# Altium schematic sheet Sheet_1_(2)_22.11.2023 _2023-11-22.schdoc
size 339 x 300 mm
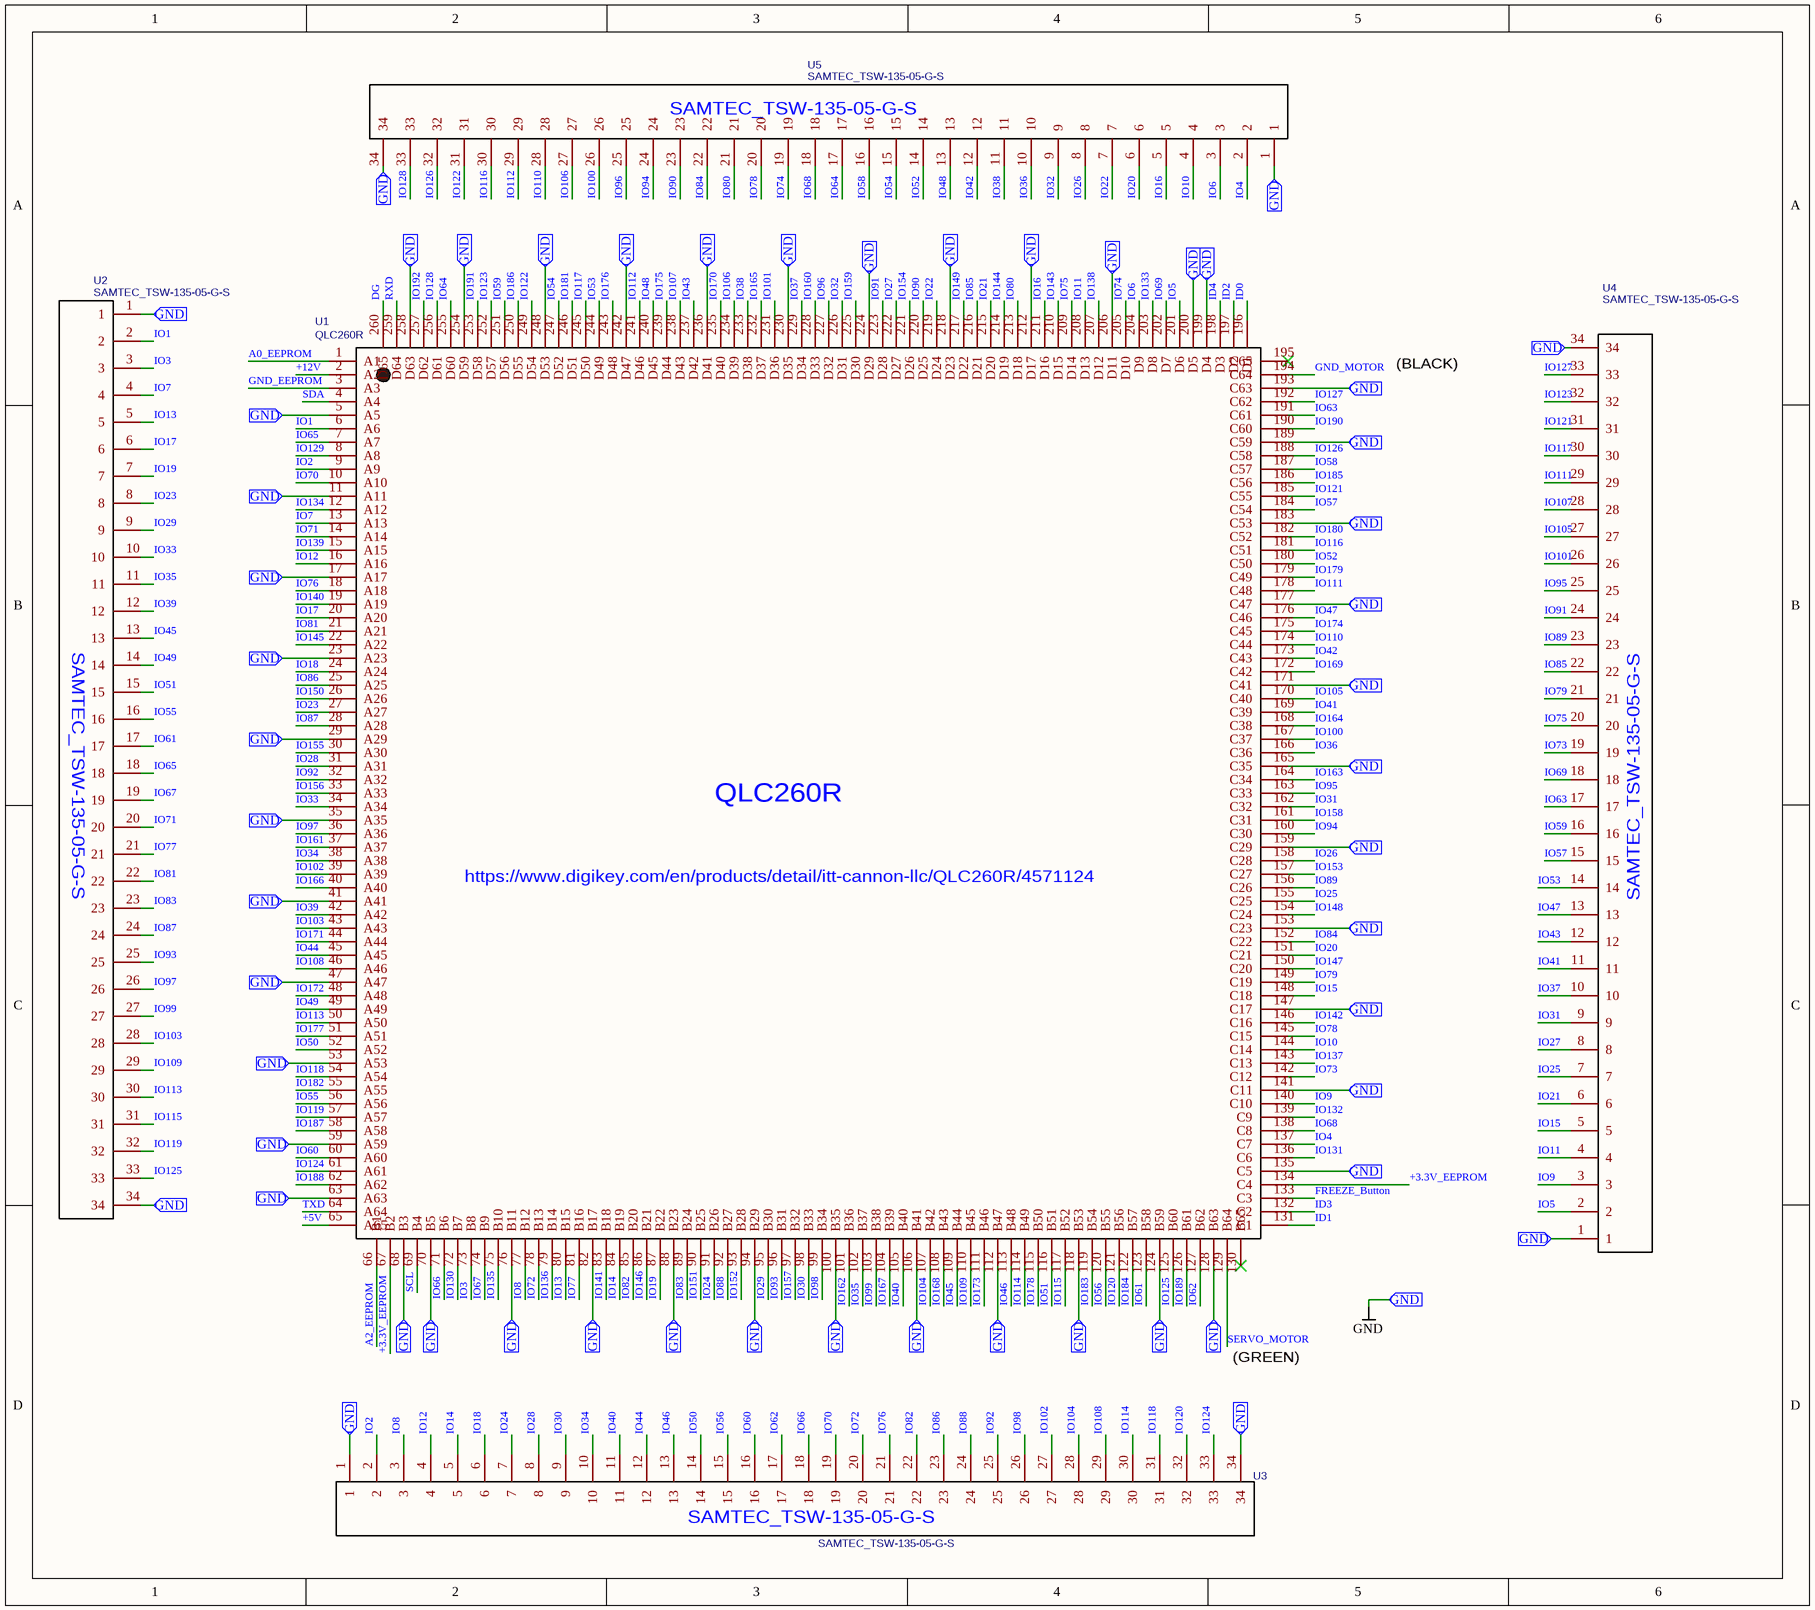
[diagram p0: Sheet_1_(2)_22.11.2023 _2023-11-22.schdoc]

## Parts
U1  QLC260R  [QLC 260R _CONNECTOR_H]
U2  SAMTEC_TSW-135-05-G-S  [CONNECTOR_01X34_SAMTECH_B]
U3  SAMTEC_TSW-135-05-G-S  [CONNECTOR_01X34_SAMTECH_B]
U4  SAMTEC_TSW-135-05-G-S  [CONNECTOR_01X34_SAMTECH_B]
U5  SAMTEC_TSW-135-05-G-S  [CONNECTOR_01X34_SAMTECH_B]

## Ports
GND (in)

## Nets
GND: U1.5(A5) U1.11(A11) U1.17(A17) U1.23(A23) U1.29(A29) U1.35(A35) U1.41(A41) U1.47(A47) U1.53(A53) U1.59(A59) U1.63(A63) U1.68(B3) U1.70(B5) U1.76(B11) U1.82(B17) U1.88(B23) U1.94(B29) U1.100(B35) U1.106(B41) U1.112(B47) U1.118(B53) U1.124(B59) U1.128(B63) U1.135(C5) U1.141(C11) U1.147(C17) U1.153(C23) U1.159(C29) U1.165(C35) U1.171(C41) U1.177(C47) U1.183(C53) U1.189(C59) U1.193(C63) U1.199(D4) U1.200(D5) U1.206(D11) U1.212(D17) U1.218(D23) U1.224(D29) U1.230(D35) U1.236(D41) U1.242(D47) U1.248(D53) U1.254(D59) U1.258(D63) U2.1 U2.34 U3.1 U3.34 U4.1 U4.34 U5.1 U5.34 ; port GND
+3.3V_EEPROM: U1.67(B2) U1.134(C4)
+5V: U1.65(A65)
+12V: U1.2(A2)
A0_EEPROM: U1.1(A1)
A2_EEPROM: U1.66(B1)
DG: U1.260(D65)
FREEZE_Button: U1.133(C3)
GND_EEPROM: U1.3(A3)
GND_MOTOR: U1.194(C64)
ID0: U1.196(D1)
ID1: U1.131(C1)
ID2: U1.197(D2)
ID3: U1.132(C2)
ID4: U1.198(D3)
IO1: U1.6(A6) U2.2
IO2: U1.9(A9) U3.2
IO3: U1.73(B8) U2.3
IO4: U1.137(C7) U5.2
IO5: U1.201(D6) U4.2
IO6: U1.204(D9) U5.3
IO7: U1.13(A13) U2.4
IO8: U1.77(B12) U3.3
IO9: U1.140(C10) U4.3
IO10: U1.144(C14) U5.4
IO11: U1.208(D13) U4.4
IO12: U1.16(A16) U3.4
IO13: U1.80(B15) U2.5
IO14: U1.84(B19) U3.5
IO15: U1.148(C18) U4.5
IO16: U1.211(D16) U5.5
IO17: U1.20(A20) U2.6
IO18: U1.24(A24) U3.6
IO19: U1.87(B22) U2.7
IO20: U1.151(C21) U5.6
IO21: U1.215(D20) U4.6
IO22: U1.219(D24) U5.7
IO23: U1.27(A27) U2.8
IO24: U1.91(B26) U3.7
IO25: U1.155(C25) U4.7
IO26: U1.158(C28) U5.8
IO27: U1.222(D27) U4.8
IO28: U1.31(A31) U3.8
IO29: U1.95(B30) U2.9
IO30: U1.98(B33) U3.9
IO31: U1.162(C32) U4.9
IO32: U1.226(D31) U5.9
IO33: U1.34(A34) U2.10
IO34: U1.38(A38) U3.10
IO35: U1.102(B37) U2.11
IO36: U1.166(C36) U5.10
IO37: U1.229(D34) U4.10
IO38: U1.233(D38) U5.11
IO39: U1.42(A42) U2.12
IO40: U1.105(B40) U3.11
IO41: U1.169(C39) U4.11
IO42: U1.173(C43) U5.12
IO43: U1.237(D42) U4.12
IO44: U1.45(A45) U3.12
IO45: U1.109(B44) U2.13
IO46: U1.113(B48) U3.13
IO47: U1.176(C46) U4.13
IO48: U1.240(D45) U5.13
IO49: U1.49(A49) U2.14
IO50: U1.52(A52) U3.14
IO51: U1.116(B51) U2.15
IO52: U1.180(C50) U5.14
IO53: U1.244(D49) U4.14
IO54: U1.247(D52) U5.15
IO55: U1.56(A56) U2.16
IO56: U1.120(B55) U3.15
IO57: U1.184(C54) U4.15
IO58: U1.187(C57) U5.16
IO59: U1.251(D56) U4.16
IO60: U1.60(A60) U3.16
IO61: U1.123(B58) U2.17
IO62: U1.127(B62) U3.17
IO63: U1.191(C61) U4.17
IO64: U1.255(D60) U5.17
IO65: U1.7(A7) U2.18
IO66: U1.71(B6) U3.18
IO67: U1.74(B9) U2.19
IO68: U1.138(C8) U5.18
IO69: U1.202(D7) U4.18
IO70: U1.10(A10) U3.19
IO71: U1.14(A14) U2.20
IO72: U1.78(B13) U3.20
IO73: U1.142(C12) U4.19
IO74: U1.205(D10) U5.19
IO75: U1.209(D14) U4.20
IO76: U1.18(A18) U3.21
IO77: U1.81(B16) U2.21
IO78: U1.145(C15) U5.20
IO79: U1.149(C19) U4.21
IO80: U1.213(D18) U5.21
IO81: U1.21(A21) U2.22
IO82: U1.85(B20) U3.22
IO83: U1.89(B24) U2.23
IO84: U1.152(C22) U5.22
IO85: U1.216(D21) U4.22
IO86: U1.25(A25) U3.23
IO87: U1.28(A28) U2.24
IO88: U1.92(B27) U3.24
IO89: U1.156(C26) U4.23
IO90: U1.220(D25) U5.23
IO91: U1.223(D28) U4.24
IO92: U1.32(A32) U3.25
IO93: U1.96(B31) U2.25
IO94: U1.160(C30) U5.24
IO95: U1.163(C33) U4.25
IO96: U1.227(D32) U5.25
IO97: U1.36(A36) U2.26
IO98: U1.99(B34) U3.26
IO99: U1.103(B38) U2.27
IO100: U1.167(C37) U5.26
IO101: U1.231(D36) U4.26
IO102: U1.39(A39) U3.27
IO103: U1.43(A43) U2.28
IO104: U1.107(B42) U3.28
IO105: U1.170(C40) U4.27
IO106: U1.234(D39) U5.27
IO107: U1.238(D43) U4.28
IO108: U1.46(A46) U3.29
IO109: U1.110(B45) U2.29
IO110: U1.174(C44) U5.28
IO111: U1.178(C48) U4.29
IO112: U1.241(D46) U5.29
IO113: U1.50(A50) U2.30
IO114: U1.114(B49) U3.30
IO115: U1.117(B52) U2.31
IO116: U1.181(C51) U5.30
IO117: U1.245(D50) U4.30
IO118: U1.54(A54) U3.31
IO119: U1.57(A57) U2.32
IO120: U1.121(B56) U3.32
IO121: U1.185(C55) U4.31
IO122: U1.249(D54) U5.31
IO123: U1.252(D57) U4.32
IO124: U1.61(A61) U3.33
IO125: U1.125(B60) U2.33
IO126: U1.188(C58) U5.32
IO127: U1.192(C62) U4.33
IO128: U1.256(D61) U5.33
IO129: U1.8(A8)
IO130: U1.72(B7)
IO131: U1.136(C6)
IO132: U1.139(C9)
IO133: U1.203(D8)
IO134: U1.12(A12)
IO135: U1.75(B10)
IO136: U1.79(B14)
IO137: U1.143(C13)
IO138: U1.207(D12)
IO139: U1.15(A15)
IO140: U1.19(A19)
IO141: U1.83(B18)
IO142: U1.146(C16)
IO143: U1.210(D15)
IO144: U1.214(D19)
IO145: U1.22(A22)
IO146: U1.86(B21)
IO147: U1.150(C20)
IO148: U1.154(C24)
IO149: U1.217(D22)
IO150: U1.26(A26)
IO151: U1.90(B25)
IO152: U1.93(B28)
IO153: U1.157(C27)
IO154: U1.221(D26)
IO155: U1.30(A30)
IO156: U1.33(A33)
IO157: U1.97(B32)
IO158: U1.161(C31)
IO159: U1.225(D30)
IO160: U1.228(D33)
IO161: U1.37(A37)
IO162: U1.101(B36)
IO163: U1.164(C34)
IO164: U1.168(C38)
IO165: U1.232(D37)
IO166: U1.40(A40)
IO167: U1.104(B39)
IO168: U1.108(B43)
IO169: U1.172(C42)
IO170: U1.235(D40)
IO171: U1.44(A44)
IO172: U1.48(A48)
IO173: U1.111(B46)
IO174: U1.175(C45)
IO175: U1.239(D44)
IO176: U1.243(D48)
IO177: U1.51(A51)
IO178: U1.115(B50)
IO179: U1.179(C49)
IO180: U1.182(C52)
IO181: U1.246(D51)
IO182: U1.55(A55)
IO183: U1.119(B54)
IO184: U1.122(B57)
IO185: U1.186(C56)
IO186: U1.250(D55)
IO187: U1.58(A58)
IO188: U1.62(A62)
IO189: U1.126(B61)
IO190: U1.190(C60)
IO191: U1.253(D58)
IO192: U1.257(D62)
RXD: U1.259(D64)
SCL: U1.69(B4)
SDA: U1.4(A4)
SERVO_MOTOR: U1.129(B64)
TXD: U1.64(A64)

Not connected (* = marked no-connect by the designer): U1 130(B65)* 195(C65)*

## Notes on the sheet
- (BLACK)
- (GREEN)

## Library data of the parts
U1 = QLC260R: Manufacturer: ITT Cannon, LLC; Contributor: venkatakrishnanr; Package Display: No; Manufacturer Part: QLC260R; Supplier: Digi-Key; Supplier Part: 1003-2400-ND; link: https://www.digikey.com/en/products/detail/itt-cannon-llc/QLC260R/4571124; spicePre: U; spiceSymbolName: QLC260R
U2-U5 = SAMTEC_TSW-135-05-G-S: Manufacturer: Samtec Inc.; Contributor: venkatakrishnanr; Manufacturer Part: TSW-135-05-G-S; Supplier: Digi-Key; Supplier Part: SAM1013-35-ND; link: https://www.digikey.in/en/products/detail/samtec-inc/TSW-135-05-G-S/1100486; spicePre: U; spiceSymbolName: SAMTEC_TSW-135-05-G-S